# Altium schematic sheet [03] - A4.SchDoc
size A4; DocumentNumber: 3; SheetNumber: 3; SheetTotal: 6
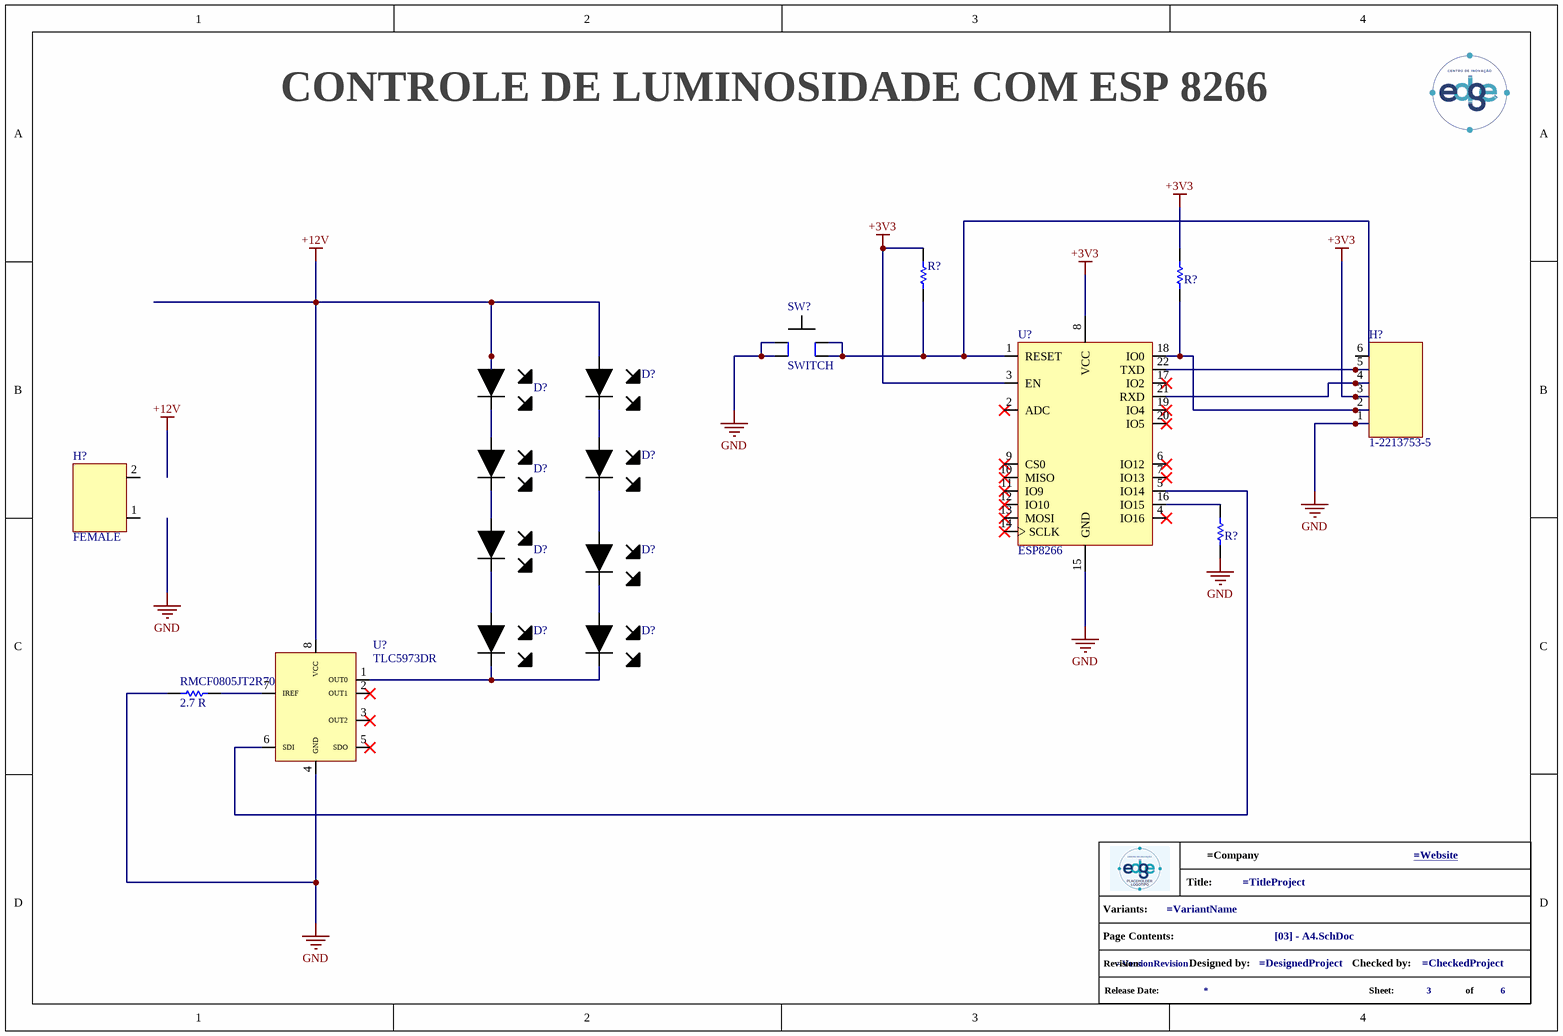
[diagram p0: [03] - A4.SchDoc]

## Parts
(Parts that share a designator on the sheet are numbered #1, #2 ... from top to bottom, then left to right.)
*?  info_project  (value not drawn)  (graphical)
D?#1  WHITE_LED  [WHITE_LED]  (value not drawn)
D?#2  WHITE_LED  [WHITE_LED]  (value not drawn)
D?#3  WHITE_LED  [WHITE_LED]  (value not drawn)
D?#4  WHITE_LED  [WHITE_LED]  (value not drawn)
D?#5  WHITE_LED  [WHITE_LED]  (value not drawn)
D?#6  WHITE_LED  [WHITE_LED]  (value not drawn)
D?#7  WHITE_LED  [WHITE_LED]  (value not drawn)
D?#8  WHITE_LED  [WHITE_LED]  (value not drawn)
H?#1  1-2213753-5
H?#2  FEMALE
R?#1  RESISTOR CFR-25JB-52-4K7  [R0805]  (value not drawn)
R?#2  CFR-25JB-52-10K  [R0603]  (value not drawn)
R?#3  CFR-25JB-52-10K  [R0603]  (value not drawn)
RMCF0805JT2R70  2.7 R  [R0805]
SW?  SWITCH
U?#1  ESP8266  [XCVR_ESP8266-12E/ESP-12E]
U?#2  TLC5973DR  [TLC5973]

## Nets
+3V3: H?#1.3 R?#1.2 R?#2.2 U?#1.3(EN) U?#1.8(VCC)
+12V: D?#1.1 D?#2.1 U?#2.8(VCC)
GND: H?#1.1 R?#3.1 RMCF0805JT2R70.1 SW?.SW1 U?#1.15(GND) U?#2.4(GND)
NetD?#1_2: D?#1.2 D?#3.1
NetD?#2_2: D?#2.2 D?#4.1
NetD?#3_2: D?#3.2 D?#5.1
NetD?#4_2: D?#4.2 D?#6.1
NetD?#5_2: D?#5.2 D?#7.1
NetD?#6_2: D?#6.2 D?#8.1
NetD?#7_2: D?#7.2 D?#8.2 U?#2.1(OUT0)
NetH?#1_2: H?#1.2 R?#2.1 U?#1.18(IO0)
NetH?#1_4: H?#1.4 U?#1.21(RXD)
NetH?#1_5: H?#1.5 U?#1.22(TXD)
NetR?#1_1: R?#1.1 SW?.SW1 U?#1.1(RESET)
NetR?#3_2: R?#3.2 U?#1.16(IO15)
NetRMCF0805JT2R70_2: RMCF0805JT2R70.2 U?#2.7(IREF)
NetU?#1_5: U?#1.5(IO14) U?#2.6(SDI)

Not connected (* = marked no-connect by the designer): H?#1 6; H?#2 1(__1) 2(_2); U?#1 2(ADC)* 4(IO16)* 6(IO12)* 7(IO13)* 9(CS0)* 10(MISO)* 11(IO9)* 12(IO10)* 13(MOSI)* 14(SCLK)* 17(IO2)* 19(IO4)* 20(IO5)*; U?#2 2(OUT1)* 3(OUT2)* 5(SDO)*

## Notes on the sheet
- CONTROLE DE LUMINOSIDADE COM ESP 8266
- (in symbol info_project) Title:; Variants:; Page Contents:; Revision:; Designed by:; Checked by:; Release Date:; Sheet:; of

## Library data of the parts
D?#1-D?#8 = WHITE_LED: LED - WHITE CLEAR T-1 3/4 T/H; Supplier 1: Digi-Key; Supplier Part Number 1: 492-2209-1-ND
H?#1 = 1-2213753-5: CONN - HEADER 6 pins; Manufacturer 1: TE Connectivity; Supplier 1: Mouser; Manufacturer Part Number 1: 1-2213753-5; Stock 1: 2922; Pricing 1: 1=1.55000, 10=1.27000, 50=1.27000, 100=1.09000, 1000=0.86200, 10000=0.74800 (USD); RoHS: Yes; RoHS Compliant: Yes; Supplier Part Number 1: 571-1-2213753-5; .SCHChecked: *
H?#2 = Alimentação: .SCHChecked: *
R?#1 = CFR-25JB-52-4K7: RES - 4.7K OHM 1/4W 5% AXIAL
R?#2 = CFR-25JB-52-10K: RES - 10K OHM 1/4W 5% AXIAL; Supplier 1: Digi-Key; Supplier Part Number 1: 10KQBK-ND
R?#3 = CFR-25JB-52-10K (1): RES 10K OHM 1/4W 5% AXIAL; Supplier 1: Digi-Key; Supplier Part Number 1: 10KQBK-ND
RMCF0805JT2R70 = RMCF0805JT2R70: RES -  2.7 OHM 1/8W 5% 0805; Manufacturer 1: Stackpole Electronics; Resistance: 2.7R; Max Power Dissipation: 125mW; Temperature Coefficient: 200ppm/°C; Supplier 1: Digi-Key; Supplier Part Number 1: 738-RMCF0805JT2R70CT-ND; Manufacturer Part Number 1: RMCF0805JT2R70; Stock 1: 439; Pricing 1: 1=0.10000, 10=0.02000, 100=0.00810, 1000=0.00366, 2500=0.00318 (USD); RoHS: Yes; Mount: Surface Mount; Case/Package: 0805; Case Code (Metric): 2012; Case Code (Imperial): 0805; Contact Plating: Tin,Matte; Min Operating Temperature: -55°C; Max Operating Temperature: 155°C; Packaging: Tape and Reel; Tolerance: 5%; Resistor Type: Thick Film; Number of Terminations: 2; Features: Automotive AEC-Q200; Series: RMCF; Length: 0.079inch; Width: 0.049inch; Height: 0.026inch; Radiation Hardening: No; RoHS Compliant: Yes; ComponentLink1URL: http://components.arrow.com/part/dataview/50862679S7247335N1174?src-supplier=Arrow+Electronics; ComponentLink1Description: http://components.arrow.com/part/dataview/50862679S7247335N1174?src-supplier=Arrow+Electronics; ComponentLink2URL: https://www.seielect.com/catalog/sei-rmcf_rmcp.pdf?src-supplier=Digi-Key; ComponentLink2Description: https://www.seielect.com/catalog/sei-rmcf_rmcp.pdf?src-supplier=Digi-Key; ComponentLink3URL: https://www.seielect.com/catalog/SEI-Packaging.pdf?src-supplier=Digi-Key; ComponentLink3Description: https://www.seielect.com/catalog/SEI-Packaging.pdf?src-supplier=Digi-Key; ComponentLink4URL: https://www.seielect.com/catalog/SEI-RMCF_RMCP.pdf?src-supplier=Avnet; ComponentLink4Description: https://www.seielect.com/catalog/SEI-RMCF_RMCP.pdf?src-supplier=Avnet; .SCHChecked: *
SW? = switch: SWITCH - 4 PINS
U?#1 = ESP8266: IC - ESP8266 SMT Module / WiFi 802.11b/g/n Transceiver Module 2.4GHz ~ 2.5GHz Integrated, Trace Surface Mount; Supplier 1: Digi-Key; Supplier Part Number 1: 1528-1438-ND
U?#2 = TLC5973DR: IC - TLC5973DR LED Lighting Drivers 3Ch 12B PWM Constant Crnt LED Dvr; Supplier 1: Mouser; Supplier Part Number 1: 595-TLC5973DR